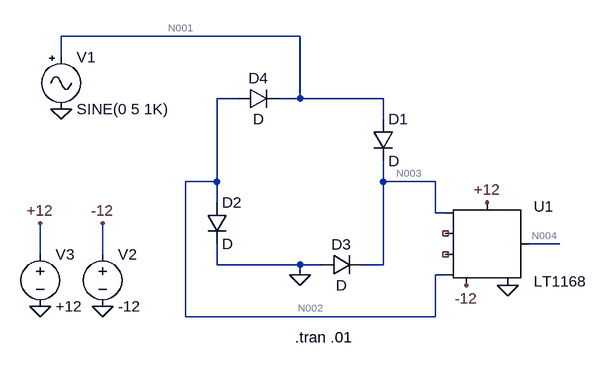
[diagram p0: schematic HW3_DiodeRectifier.asc]
HW3_DiodeRectifier.asc, the LTspice schematic file:
Version 4
SHEET 1 880 680
WIRE 32 0 -336 0
WIRE -336 32 -336 0
WIRE -64 96 -96 96
WIRE 32 96 32 0
WIRE 32 96 0 96
WIRE 160 96 32 96
WIRE 160 128 160 96
WIRE -96 224 -96 96
WIRE -96 224 -144 224
WIRE 160 224 160 192
WIRE 240 224 160 224
WIRE -96 256 -96 224
WIRE 240 272 240 224
WIRE 256 272 240 272
WIRE 432 320 384 320
WIRE -368 336 -368 288
WIRE -272 336 -272 288
WIRE -96 352 -96 320
WIRE 32 352 -96 352
WIRE 64 352 32 352
WIRE 160 352 160 224
WIRE 160 352 128 352
WIRE 32 368 32 352
WIRE 256 368 240 368
WIRE -144 432 -144 224
WIRE 240 432 240 368
WIRE 240 432 -144 432
FLAG -336 112 0
FLAG 32 368 0
FLAG 352 384 0
FLAG -368 416 0
FLAG -272 416 0
FLAG 320 256 +12
FLAG 288 384 -12
FLAG -368 288 +12
FLAG -272 288 -12
SYMBOL diode -64 112 R270
WINDOW 0 32 32 VTop 2
WINDOW 3 0 32 VBottom 2
SYMATTR InstName D4
SYMBOL diode 64 368 R270
WINDOW 0 32 32 VTop 2
WINDOW 3 0 32 VBottom 2
SYMATTR InstName D3
SYMBOL Misc\\signal -336 16 R0
WINDOW 123 0 0 Left 0
WINDOW 39 0 0 Left 0
SYMATTR InstName V1
SYMATTR Value SINE(0 5 1K)
SYMBOL diode 144 128 R0
SYMATTR InstName D1
SYMBOL diode -112 256 R0
SYMATTR InstName D2
SYMBOL OpAmps\\LT1168 320 320 R0
SYMATTR InstName U1
SYMBOL voltage -272 320 R0
WINDOW 123 0 0 Left 0
WINDOW 39 0 0 Left 0
SYMATTR InstName V2
SYMATTR Value -12
SYMBOL voltage -368 320 R0
WINDOW 123 0 0 Left 0
WINDOW 39 0 0 Left 0
SYMATTR InstName V3
SYMATTR Value +12
TEXT 24 464 Left 2 !.tran .01

The netlist it stands for:
* HW3_DiodeRectifier.asc
D4 N002 N001 D
D3 0 N003 D
V1 N001 0 SINE(0 5 1K)
D1 N001 N003 D
D2 N002 0 D
XU1 NC_01 N002 N003 -12 0 N004 +12 NC_02 LT1168
V2 -12 0 -12
V3 +12 0 +12
.model D D
.lib standard.dio
.tran .01
.lib LTC.lib
.backanno
.end

* Results of the author's LTspice run, read from the files saved beside the schematic
* Operating Point, zero values left out:
*   V(+12) = 12 V
*   V(-12) = -12 V
*   I(V2) = 350 µA
*   I(V3) = -350 µA
*   Ix(u1:4) = -350 µA
*   Ix(u1:7) = 350 µA
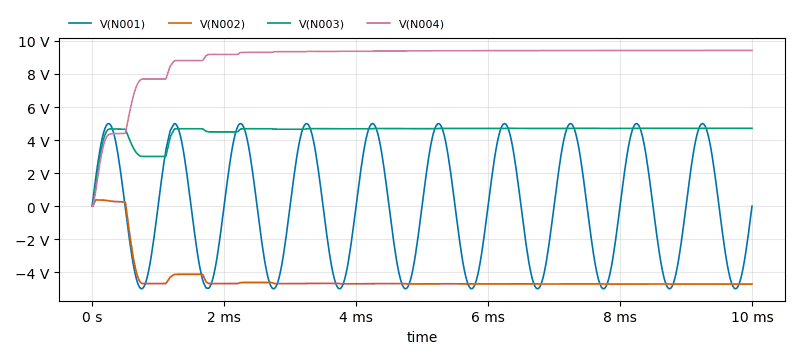
[diagram p1: Transient Analysis of HW3_DiodeRectifier.asc, plotted from the saved traces]
* Transient Analysis, 1 run:
*   V(N001): min -5 V, max 5 V, average -382.8 µV, rms 3.535 V, last 0 V
*   V(N002): min -4.717 V, max 379.2 mV, average -4.366 V, rms 4.514 V, last -4.716 V
*   V(N003): min 0 V, max 4.716 V, average 4.542 V, rms 4.572 V, last 4.709 V
*   V(N004): min 0 V, max 9.429 V, average 8.909 V, rms 9.022 V, last 9.427 V